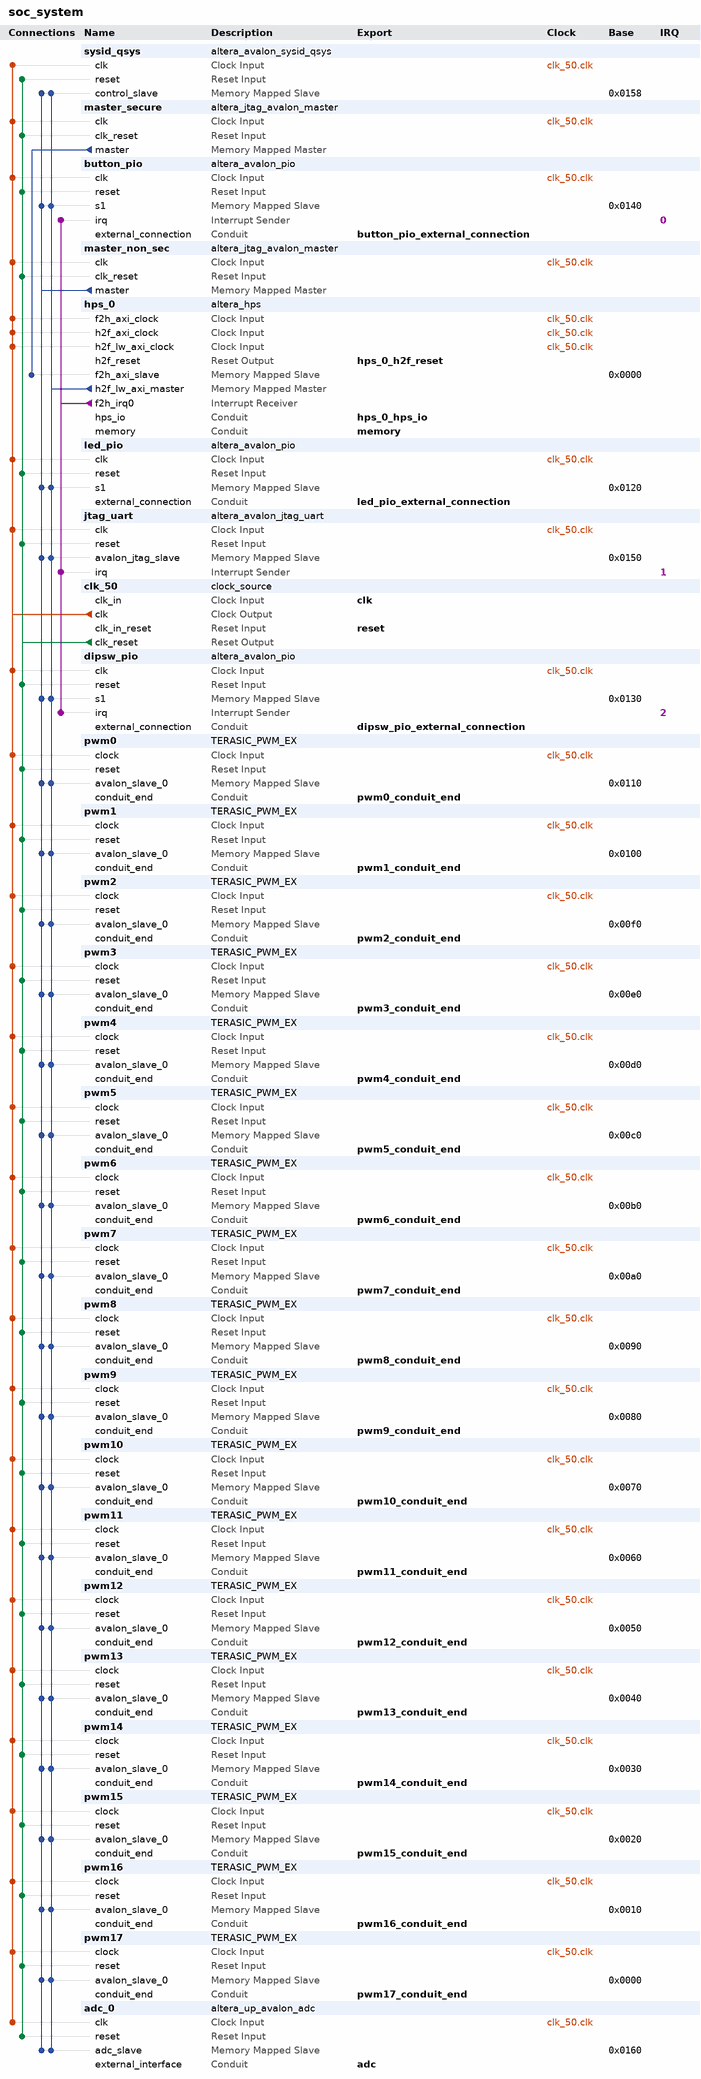
[diagram p0: system contents]
# Platform Designer (Qsys) system soc_system, Cyclone V 5CSEMA4U23C6
# Parameters at their usual value, and those the tool derives, are not listed.
package require -exact qsys 17.0
create_system soc_system
set_project_property DEVICE_FAMILY {Cyclone V}
set_project_property DEVICE 5CSEMA4U23C6

add_instance sysid_qsys altera_avalon_sysid_qsys 17.0
set_instance_parameter_value sysid_qsys id 0

add_instance master_secure altera_jtag_avalon_master 17.0

add_instance button_pio altera_avalon_pio 17.0
set_instance_parameter_value button_pio bitClearingEdgeCapReg true
set_instance_parameter_value button_pio captureEdge true
set_instance_parameter_value button_pio direction Input
set_instance_parameter_value button_pio edgeType FALLING
set_instance_parameter_value button_pio generateIRQ true
set_instance_parameter_value button_pio irqType EDGE
set_instance_parameter_value button_pio width 2

add_instance master_non_sec altera_jtag_avalon_master 17.0

add_instance hps_0 altera_hps 17.0
set_instance_parameter_value hps_0 EMAC1_Mode RGMII
set_instance_parameter_value hps_0 EMAC1_PinMuxing {HPS I/O Set 0}
set_instance_parameter_value hps_0 F2SCLK_COLDRST_Enable false
set_instance_parameter_value hps_0 F2SCLK_DBGRST_Enable false
set_instance_parameter_value hps_0 F2SCLK_WARMRST_Enable false
set_instance_parameter_value hps_0 F2SINTERRUPT_Enable true
set_instance_parameter_value hps_0 F2S_Width 2
set_instance_parameter_value hps_0 FPGA_PERIPHERAL_OUTPUT_CLOCK_FREQ_EMAC0_GTX_CLK 100
set_instance_parameter_value hps_0 FPGA_PERIPHERAL_OUTPUT_CLOCK_FREQ_EMAC0_MD_CLK 100.0
set_instance_parameter_value hps_0 FPGA_PERIPHERAL_OUTPUT_CLOCK_FREQ_EMAC1_GTX_CLK 100
set_instance_parameter_value hps_0 FPGA_PERIPHERAL_OUTPUT_CLOCK_FREQ_EMAC1_MD_CLK 100.0
set_instance_parameter_value hps_0 HPS_PROTOCOL DDR3
set_instance_parameter_value hps_0 I2C0_Mode I2C
set_instance_parameter_value hps_0 I2C0_PinMuxing {HPS I/O Set 0}
set_instance_parameter_value hps_0 I2C1_Mode I2C
set_instance_parameter_value hps_0 I2C1_PinMuxing {HPS I/O Set 0}
set_instance_parameter_value hps_0 LWH2F_Enable true
set_instance_parameter_value hps_0 MEM_BANKADDR_WIDTH 3
set_instance_parameter_value hps_0 MEM_CLK_FREQ 400.0
set_instance_parameter_value hps_0 MEM_COL_ADDR_WIDTH 10
set_instance_parameter_value hps_0 MEM_DQ_WIDTH 32
set_instance_parameter_value hps_0 MEM_DRV_STR RZQ/7
set_instance_parameter_value hps_0 MEM_ROW_ADDR_WIDTH 15
set_instance_parameter_value hps_0 MEM_RTT_NOM RZQ/4
set_instance_parameter_value hps_0 MEM_RTT_WR RZQ/4
set_instance_parameter_value hps_0 MEM_TCL 11
set_instance_parameter_value hps_0 MEM_TFAW_NS 30.0
set_instance_parameter_value hps_0 MEM_TRAS_NS 35.0
set_instance_parameter_value hps_0 MEM_TRCD_NS 13.75
set_instance_parameter_value hps_0 MEM_TRFC_NS 260.0
set_instance_parameter_value hps_0 MEM_TRP_NS 13.75
set_instance_parameter_value hps_0 MEM_VENDOR Micron
set_instance_parameter_value hps_0 MEM_WTCL 8
set_instance_parameter_value hps_0 QSPI_Mode N/A
set_instance_parameter_value hps_0 QSPI_PinMuxing Unused
set_instance_parameter_value hps_0 REF_CLK_FREQ 25.0
set_instance_parameter_value hps_0 S2FCLK_USER2CLK 5
set_instance_parameter_value hps_0 S2F_Width 3
set_instance_parameter_value hps_0 SDIO_Mode {4-bit Data}
set_instance_parameter_value hps_0 SDIO_PinMuxing {HPS I/O Set 0}
set_instance_parameter_value hps_0 SPIM1_Mode {Single Slave Select}
set_instance_parameter_value hps_0 SPIM1_PinMuxing {HPS I/O Set 0}
set_instance_parameter_value hps_0 STM_Enable false
set_instance_parameter_value hps_0 TIMING_BOARD_AC_SKEW 0.02
set_instance_parameter_value hps_0 TIMING_BOARD_AC_TO_CK_SKEW 0.01
set_instance_parameter_value hps_0 TIMING_BOARD_DQ_TO_DQS_SKEW 0.05
set_instance_parameter_value hps_0 TIMING_BOARD_MAX_CK_DELAY 0.03
set_instance_parameter_value hps_0 TIMING_BOARD_MAX_DQS_DELAY 0.02
set_instance_parameter_value hps_0 TIMING_BOARD_SKEW_BETWEEN_DQS 0.06
set_instance_parameter_value hps_0 TIMING_BOARD_SKEW_CKDQS_DIMM_MAX 0.12
set_instance_parameter_value hps_0 TIMING_BOARD_SKEW_CKDQS_DIMM_MIN 0.06
set_instance_parameter_value hps_0 TIMING_BOARD_SKEW_WITHIN_DQS 0.01
set_instance_parameter_value hps_0 TIMING_TDH 65
set_instance_parameter_value hps_0 TIMING_TDQSCK 255
set_instance_parameter_value hps_0 TIMING_TDQSQ 125
set_instance_parameter_value hps_0 TIMING_TDS 30
set_instance_parameter_value hps_0 TIMING_TIH 140
set_instance_parameter_value hps_0 TIMING_TIS 180
set_instance_parameter_value hps_0 TIMING_TQSH 0.4
set_instance_parameter_value hps_0 UART0_Mode {No Flow Control}
set_instance_parameter_value hps_0 UART0_PinMuxing {HPS I/O Set 0}
set_instance_parameter_value hps_0 USB1_Mode SDR
set_instance_parameter_value hps_0 USB1_PinMuxing {HPS I/O Set 0}
set_instance_parameter_value hps_0 desired_cfg_clk_mhz 100.0
set_instance_parameter_value hps_0 desired_qspi_clk_mhz 400.0

add_instance led_pio altera_avalon_pio 17.0
set_instance_parameter_value led_pio direction Output
set_instance_parameter_value led_pio width 7

add_instance jtag_uart altera_avalon_jtag_uart 17.0
set_instance_parameter_value jtag_uart simInteractiveOptions NO_INTERACTIVE_WINDOWS

add_instance clk_50 clock_source 17.0
set_instance_parameter_value clk_50 clockFrequency 50000000

add_instance dipsw_pio altera_avalon_pio 17.0
set_instance_parameter_value dipsw_pio bitClearingEdgeCapReg true
set_instance_parameter_value dipsw_pio captureEdge true
set_instance_parameter_value dipsw_pio direction Input
set_instance_parameter_value dipsw_pio edgeType ANY
set_instance_parameter_value dipsw_pio generateIRQ true
set_instance_parameter_value dipsw_pio irqType EDGE
set_instance_parameter_value dipsw_pio width 4

add_instance pwm0 TERASIC_PWM_EX 1.0

add_instance pwm1 TERASIC_PWM_EX 1.0

add_instance pwm2 TERASIC_PWM_EX 1.0

add_instance pwm3 TERASIC_PWM_EX 1.0

add_instance pwm4 TERASIC_PWM_EX 1.0

add_instance pwm5 TERASIC_PWM_EX 1.0

add_instance pwm6 TERASIC_PWM_EX 1.0

add_instance pwm7 TERASIC_PWM_EX 1.0

add_instance pwm8 TERASIC_PWM_EX 1.0

add_instance pwm9 TERASIC_PWM_EX 1.0

add_instance pwm10 TERASIC_PWM_EX 1.0

add_instance pwm11 TERASIC_PWM_EX 1.0

add_instance pwm12 TERASIC_PWM_EX 1.0

add_instance pwm13 TERASIC_PWM_EX 1.0

add_instance pwm14 TERASIC_PWM_EX 1.0

add_instance pwm15 TERASIC_PWM_EX 1.0

add_instance pwm16 TERASIC_PWM_EX 1.0

add_instance pwm17 TERASIC_PWM_EX 1.0

add_instance adc_0 altera_up_avalon_adc 17.0
set_instance_parameter_value adc_0 board DE0-Nano-SoC
set_instance_parameter_value adc_0 numch_ 8

# connections
add_connection clk_50.clk adc_0.clk clock
add_connection clk_50.clk button_pio.clk clock
add_connection clk_50.clk dipsw_pio.clk clock
add_connection clk_50.clk hps_0.f2h_axi_clock clock
add_connection clk_50.clk hps_0.h2f_axi_clock clock
add_connection clk_50.clk hps_0.h2f_lw_axi_clock clock
add_connection clk_50.clk jtag_uart.clk clock
add_connection clk_50.clk led_pio.clk clock
add_connection clk_50.clk master_non_sec.clk clock
add_connection clk_50.clk master_secure.clk clock
add_connection clk_50.clk pwm0.clock clock
add_connection clk_50.clk pwm1.clock clock
add_connection clk_50.clk pwm2.clock clock
add_connection clk_50.clk pwm3.clock clock
add_connection clk_50.clk pwm4.clock clock
add_connection clk_50.clk pwm5.clock clock
add_connection clk_50.clk pwm6.clock clock
add_connection clk_50.clk pwm7.clock clock
add_connection clk_50.clk pwm8.clock clock
add_connection clk_50.clk pwm9.clock clock
add_connection clk_50.clk pwm10.clock clock
add_connection clk_50.clk pwm11.clock clock
add_connection clk_50.clk pwm12.clock clock
add_connection clk_50.clk pwm13.clock clock
add_connection clk_50.clk pwm14.clock clock
add_connection clk_50.clk pwm15.clock clock
add_connection clk_50.clk pwm16.clock clock
add_connection clk_50.clk pwm17.clock clock
add_connection clk_50.clk sysid_qsys.clk clock
add_connection clk_50.clk_reset adc_0.reset reset
add_connection clk_50.clk_reset button_pio.reset reset
add_connection clk_50.clk_reset dipsw_pio.reset reset
add_connection clk_50.clk_reset jtag_uart.reset reset
add_connection clk_50.clk_reset led_pio.reset reset
add_connection clk_50.clk_reset master_non_sec.clk_reset reset
add_connection clk_50.clk_reset master_secure.clk_reset reset
add_connection clk_50.clk_reset pwm0.reset reset
add_connection clk_50.clk_reset pwm1.reset reset
add_connection clk_50.clk_reset pwm2.reset reset
add_connection clk_50.clk_reset pwm3.reset reset
add_connection clk_50.clk_reset pwm4.reset reset
add_connection clk_50.clk_reset pwm5.reset reset
add_connection clk_50.clk_reset pwm6.reset reset
add_connection clk_50.clk_reset pwm7.reset reset
add_connection clk_50.clk_reset pwm8.reset reset
add_connection clk_50.clk_reset pwm9.reset reset
add_connection clk_50.clk_reset pwm10.reset reset
add_connection clk_50.clk_reset pwm11.reset reset
add_connection clk_50.clk_reset pwm12.reset reset
add_connection clk_50.clk_reset pwm13.reset reset
add_connection clk_50.clk_reset pwm14.reset reset
add_connection clk_50.clk_reset pwm15.reset reset
add_connection clk_50.clk_reset pwm16.reset reset
add_connection clk_50.clk_reset pwm17.reset reset
add_connection clk_50.clk_reset sysid_qsys.reset reset
add_connection hps_0.h2f_lw_axi_master adc_0.adc_slave avalon
set_connection_parameter_value hps_0.h2f_lw_axi_master/adc_0.adc_slave baseAddress 0x0160
add_connection hps_0.h2f_lw_axi_master button_pio.s1 avalon
set_connection_parameter_value hps_0.h2f_lw_axi_master/button_pio.s1 baseAddress 0x0140
add_connection hps_0.h2f_lw_axi_master dipsw_pio.s1 avalon
set_connection_parameter_value hps_0.h2f_lw_axi_master/dipsw_pio.s1 baseAddress 0x0130
add_connection hps_0.h2f_lw_axi_master jtag_uart.avalon_jtag_slave avalon
set_connection_parameter_value hps_0.h2f_lw_axi_master/jtag_uart.avalon_jtag_slave baseAddress 0x0150
add_connection hps_0.h2f_lw_axi_master led_pio.s1 avalon
set_connection_parameter_value hps_0.h2f_lw_axi_master/led_pio.s1 baseAddress 0x0120
add_connection hps_0.h2f_lw_axi_master pwm0.avalon_slave_0 avalon
set_connection_parameter_value hps_0.h2f_lw_axi_master/pwm0.avalon_slave_0 baseAddress 0x0110
add_connection hps_0.h2f_lw_axi_master pwm1.avalon_slave_0 avalon
set_connection_parameter_value hps_0.h2f_lw_axi_master/pwm1.avalon_slave_0 baseAddress 0x0100
add_connection hps_0.h2f_lw_axi_master pwm2.avalon_slave_0 avalon
set_connection_parameter_value hps_0.h2f_lw_axi_master/pwm2.avalon_slave_0 baseAddress 0x00f0
add_connection hps_0.h2f_lw_axi_master pwm3.avalon_slave_0 avalon
set_connection_parameter_value hps_0.h2f_lw_axi_master/pwm3.avalon_slave_0 baseAddress 0x00e0
add_connection hps_0.h2f_lw_axi_master pwm4.avalon_slave_0 avalon
set_connection_parameter_value hps_0.h2f_lw_axi_master/pwm4.avalon_slave_0 baseAddress 0x00d0
add_connection hps_0.h2f_lw_axi_master pwm5.avalon_slave_0 avalon
set_connection_parameter_value hps_0.h2f_lw_axi_master/pwm5.avalon_slave_0 baseAddress 0x00c0
add_connection hps_0.h2f_lw_axi_master pwm6.avalon_slave_0 avalon
set_connection_parameter_value hps_0.h2f_lw_axi_master/pwm6.avalon_slave_0 baseAddress 0x00b0
add_connection hps_0.h2f_lw_axi_master pwm7.avalon_slave_0 avalon
set_connection_parameter_value hps_0.h2f_lw_axi_master/pwm7.avalon_slave_0 baseAddress 0x00a0
add_connection hps_0.h2f_lw_axi_master pwm8.avalon_slave_0 avalon
set_connection_parameter_value hps_0.h2f_lw_axi_master/pwm8.avalon_slave_0 baseAddress 0x0090
add_connection hps_0.h2f_lw_axi_master pwm9.avalon_slave_0 avalon
set_connection_parameter_value hps_0.h2f_lw_axi_master/pwm9.avalon_slave_0 baseAddress 0x0080
add_connection hps_0.h2f_lw_axi_master pwm10.avalon_slave_0 avalon
set_connection_parameter_value hps_0.h2f_lw_axi_master/pwm10.avalon_slave_0 baseAddress 0x0070
add_connection hps_0.h2f_lw_axi_master pwm11.avalon_slave_0 avalon
set_connection_parameter_value hps_0.h2f_lw_axi_master/pwm11.avalon_slave_0 baseAddress 0x0060
add_connection hps_0.h2f_lw_axi_master pwm12.avalon_slave_0 avalon
set_connection_parameter_value hps_0.h2f_lw_axi_master/pwm12.avalon_slave_0 baseAddress 0x0050
add_connection hps_0.h2f_lw_axi_master pwm13.avalon_slave_0 avalon
set_connection_parameter_value hps_0.h2f_lw_axi_master/pwm13.avalon_slave_0 baseAddress 0x0040
add_connection hps_0.h2f_lw_axi_master pwm14.avalon_slave_0 avalon
set_connection_parameter_value hps_0.h2f_lw_axi_master/pwm14.avalon_slave_0 baseAddress 0x0030
add_connection hps_0.h2f_lw_axi_master pwm15.avalon_slave_0 avalon
set_connection_parameter_value hps_0.h2f_lw_axi_master/pwm15.avalon_slave_0 baseAddress 0x0020
add_connection hps_0.h2f_lw_axi_master pwm16.avalon_slave_0 avalon
set_connection_parameter_value hps_0.h2f_lw_axi_master/pwm16.avalon_slave_0 baseAddress 0x0010
add_connection hps_0.h2f_lw_axi_master pwm17.avalon_slave_0 avalon
set_connection_parameter_value hps_0.h2f_lw_axi_master/pwm17.avalon_slave_0 baseAddress 0x0000
add_connection hps_0.h2f_lw_axi_master sysid_qsys.control_slave avalon
set_connection_parameter_value hps_0.h2f_lw_axi_master/sysid_qsys.control_slave baseAddress 0x0158
add_connection master_non_sec.master adc_0.adc_slave avalon
set_connection_parameter_value master_non_sec.master/adc_0.adc_slave baseAddress 0x0160
add_connection master_non_sec.master button_pio.s1 avalon
set_connection_parameter_value master_non_sec.master/button_pio.s1 baseAddress 0x0140
add_connection master_non_sec.master dipsw_pio.s1 avalon
set_connection_parameter_value master_non_sec.master/dipsw_pio.s1 baseAddress 0x0130
add_connection master_non_sec.master jtag_uart.avalon_jtag_slave avalon
set_connection_parameter_value master_non_sec.master/jtag_uart.avalon_jtag_slave baseAddress 0x0150
add_connection master_non_sec.master led_pio.s1 avalon
set_connection_parameter_value master_non_sec.master/led_pio.s1 baseAddress 0x0120
add_connection master_non_sec.master pwm0.avalon_slave_0 avalon
set_connection_parameter_value master_non_sec.master/pwm0.avalon_slave_0 baseAddress 0x0110
add_connection master_non_sec.master pwm1.avalon_slave_0 avalon
set_connection_parameter_value master_non_sec.master/pwm1.avalon_slave_0 baseAddress 0x0100
add_connection master_non_sec.master pwm2.avalon_slave_0 avalon
set_connection_parameter_value master_non_sec.master/pwm2.avalon_slave_0 baseAddress 0x00f0
add_connection master_non_sec.master pwm3.avalon_slave_0 avalon
set_connection_parameter_value master_non_sec.master/pwm3.avalon_slave_0 baseAddress 0x00e0
add_connection master_non_sec.master pwm4.avalon_slave_0 avalon
set_connection_parameter_value master_non_sec.master/pwm4.avalon_slave_0 baseAddress 0x00d0
add_connection master_non_sec.master pwm5.avalon_slave_0 avalon
set_connection_parameter_value master_non_sec.master/pwm5.avalon_slave_0 baseAddress 0x00c0
add_connection master_non_sec.master pwm6.avalon_slave_0 avalon
set_connection_parameter_value master_non_sec.master/pwm6.avalon_slave_0 baseAddress 0x00b0
add_connection master_non_sec.master pwm7.avalon_slave_0 avalon
set_connection_parameter_value master_non_sec.master/pwm7.avalon_slave_0 baseAddress 0x00a0
add_connection master_non_sec.master pwm8.avalon_slave_0 avalon
set_connection_parameter_value master_non_sec.master/pwm8.avalon_slave_0 baseAddress 0x0090
add_connection master_non_sec.master pwm9.avalon_slave_0 avalon
set_connection_parameter_value master_non_sec.master/pwm9.avalon_slave_0 baseAddress 0x0080
add_connection master_non_sec.master pwm10.avalon_slave_0 avalon
set_connection_parameter_value master_non_sec.master/pwm10.avalon_slave_0 baseAddress 0x0070
add_connection master_non_sec.master pwm11.avalon_slave_0 avalon
set_connection_parameter_value master_non_sec.master/pwm11.avalon_slave_0 baseAddress 0x0060
add_connection master_non_sec.master pwm12.avalon_slave_0 avalon
set_connection_parameter_value master_non_sec.master/pwm12.avalon_slave_0 baseAddress 0x0050
add_connection master_non_sec.master pwm13.avalon_slave_0 avalon
set_connection_parameter_value master_non_sec.master/pwm13.avalon_slave_0 baseAddress 0x0040
add_connection master_non_sec.master pwm14.avalon_slave_0 avalon
set_connection_parameter_value master_non_sec.master/pwm14.avalon_slave_0 baseAddress 0x0030
add_connection master_non_sec.master pwm15.avalon_slave_0 avalon
set_connection_parameter_value master_non_sec.master/pwm15.avalon_slave_0 baseAddress 0x0020
add_connection master_non_sec.master pwm16.avalon_slave_0 avalon
set_connection_parameter_value master_non_sec.master/pwm16.avalon_slave_0 baseAddress 0x0010
add_connection master_non_sec.master pwm17.avalon_slave_0 avalon
set_connection_parameter_value master_non_sec.master/pwm17.avalon_slave_0 baseAddress 0x0000
add_connection master_non_sec.master sysid_qsys.control_slave avalon
set_connection_parameter_value master_non_sec.master/sysid_qsys.control_slave baseAddress 0x0158
add_connection master_secure.master hps_0.f2h_axi_slave avalon
set_connection_parameter_value master_secure.master/hps_0.f2h_axi_slave baseAddress 0x0000
add_connection hps_0.f2h_irq0 button_pio.irq interrupt
set_connection_parameter_value hps_0.f2h_irq0/button_pio.irq irqNumber 0
add_connection hps_0.f2h_irq0 dipsw_pio.irq interrupt
set_connection_parameter_value hps_0.f2h_irq0/dipsw_pio.irq irqNumber 2
add_connection hps_0.f2h_irq0 jtag_uart.irq interrupt
set_connection_parameter_value hps_0.f2h_irq0/jtag_uart.irq irqNumber 1

# exported interfaces
add_interface adc conduit end
set_interface_property adc EXPORT_OF adc_0.external_interface
add_interface button_pio_external_connection conduit end
set_interface_property button_pio_external_connection EXPORT_OF button_pio.external_connection
add_interface clk clock sink
set_interface_property clk EXPORT_OF clk_50.clk_in
add_interface dipsw_pio_external_connection conduit end
set_interface_property dipsw_pio_external_connection EXPORT_OF dipsw_pio.external_connection
add_interface hps_0_h2f_reset reset source
set_interface_property hps_0_h2f_reset EXPORT_OF hps_0.h2f_reset
add_interface hps_0_hps_io conduit end
set_interface_property hps_0_hps_io EXPORT_OF hps_0.hps_io
add_interface led_pio_external_connection conduit end
set_interface_property led_pio_external_connection EXPORT_OF led_pio.external_connection
add_interface memory conduit end
set_interface_property memory EXPORT_OF hps_0.memory
add_interface pwm0_conduit_end conduit end
set_interface_property pwm0_conduit_end EXPORT_OF pwm0.conduit_end
add_interface pwm10_conduit_end conduit end
set_interface_property pwm10_conduit_end EXPORT_OF pwm10.conduit_end
add_interface pwm11_conduit_end conduit end
set_interface_property pwm11_conduit_end EXPORT_OF pwm11.conduit_end
add_interface pwm12_conduit_end conduit end
set_interface_property pwm12_conduit_end EXPORT_OF pwm12.conduit_end
add_interface pwm13_conduit_end conduit end
set_interface_property pwm13_conduit_end EXPORT_OF pwm13.conduit_end
add_interface pwm14_conduit_end conduit end
set_interface_property pwm14_conduit_end EXPORT_OF pwm14.conduit_end
add_interface pwm15_conduit_end conduit end
set_interface_property pwm15_conduit_end EXPORT_OF pwm15.conduit_end
add_interface pwm16_conduit_end conduit end
set_interface_property pwm16_conduit_end EXPORT_OF pwm16.conduit_end
add_interface pwm17_conduit_end conduit end
set_interface_property pwm17_conduit_end EXPORT_OF pwm17.conduit_end
add_interface pwm1_conduit_end conduit end
set_interface_property pwm1_conduit_end EXPORT_OF pwm1.conduit_end
add_interface pwm2_conduit_end conduit end
set_interface_property pwm2_conduit_end EXPORT_OF pwm2.conduit_end
add_interface pwm3_conduit_end conduit end
set_interface_property pwm3_conduit_end EXPORT_OF pwm3.conduit_end
add_interface pwm4_conduit_end conduit end
set_interface_property pwm4_conduit_end EXPORT_OF pwm4.conduit_end
add_interface pwm5_conduit_end conduit end
set_interface_property pwm5_conduit_end EXPORT_OF pwm5.conduit_end
add_interface pwm6_conduit_end conduit end
set_interface_property pwm6_conduit_end EXPORT_OF pwm6.conduit_end
add_interface pwm7_conduit_end conduit end
set_interface_property pwm7_conduit_end EXPORT_OF pwm7.conduit_end
add_interface pwm8_conduit_end conduit end
set_interface_property pwm8_conduit_end EXPORT_OF pwm8.conduit_end
add_interface pwm9_conduit_end conduit end
set_interface_property pwm9_conduit_end EXPORT_OF pwm9.conduit_end
add_interface reset reset sink
set_interface_property reset EXPORT_OF clk_50.clk_in_reset

set_interconnect_requirement {$system} qsys_mm.clockCrossingAdapter HANDSHAKE
set_interconnect_requirement {$system} qsys_mm.maxAdditionalLatency 1

save_system soc_system.qsys
